# Altium schematic sheet FT232.SchDoc
size A4; SheetNumber: 4; SheetTotal: 5
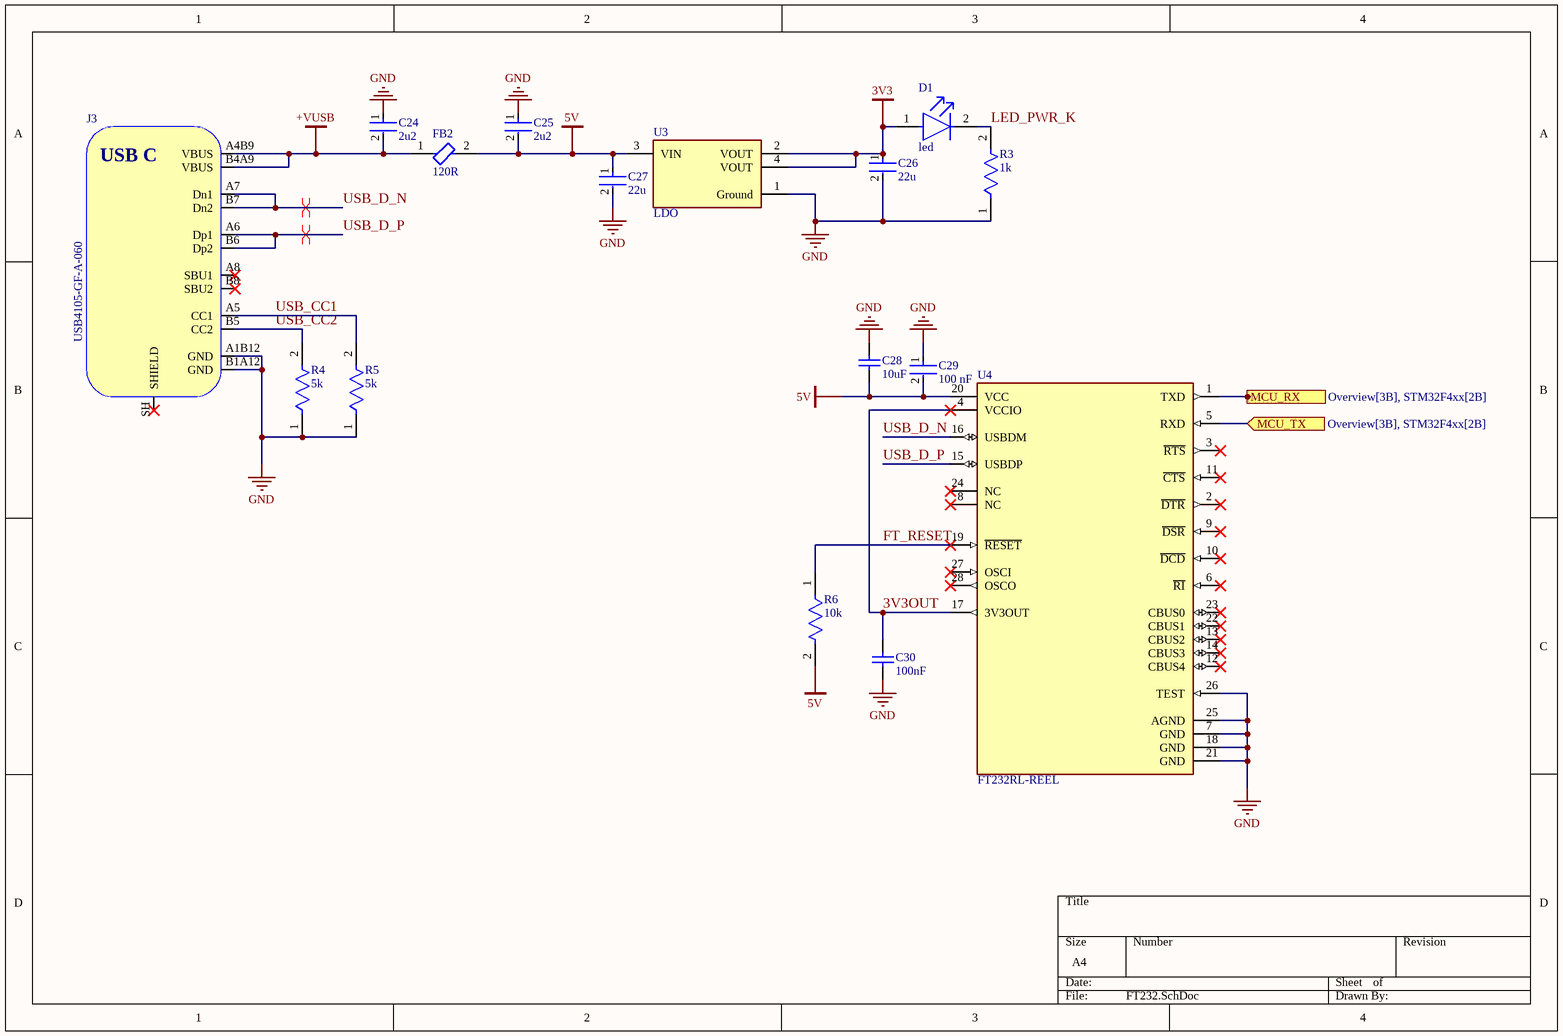
[diagram p0: FT232.SchDoc]

## Parts
C24  2u2  [FP-CC0603-DA-MFG]
C25  2u2  [FP-CC0603-DA-MFG]
C26  22u  [FP-GRM21B-0_2-e0_2_0_7-IPC_C]
C27  22u  [FP-GRM21B-0_2-e0_2_0_7-IPC_C]
C28  10uF  [CAPC0603(1608)100_M]
C29  100 nF  [FP-C0402-BB-MFG]
C30  100nF  [CAPC2013X145X50ML20T25]
D1  led  [FP-SM0402GC-MFG]
FB2  120R  [FP-BLM21-0_2-t0_85-e0_5-IPC_C]
J3  USB4105-GF-A-060  [USB4105-GF-A-060]
R3  1k  [FP-MCS0402-IPC_C]
R4  5k  [FP-TFCR0603-IPC_A]
R5  5k  [FP-TFCR0603-IPC_A]
R6  10k  [FP-AC0603-IPC_A]
U3  LDO  [FP-AMS1117-IPC_C]
U4  FT232RL-REEL  [FP-SSOP-28-MFG]

## Ports
MCU_RX (out, see Overview[3B], STM32F4xx[2B]), MCU_TX (in, see Overview[3B], STM32F4xx[2B])

## Nets
3V3: C26.1 D1.1(A) U3.2(VOUT) U3.4(VOUT)
5V: C25.2 C27.1 C28.1 C29.2 FB2.2 R6.2 U3.3(VIN) U4.20(VCC)
+VUSB: C24.2 FB2.1 J3.A4B9(VBUS) J3.B4A9(VBUS)
GND: C24.1 C25.1 C26.2 C27.2 C28.2 C29.1 C30.1 J3.A1B12(GND) J3.B1A12(GND) R3.1 R4.1 R5.1 U3.1(Ground) U4.7(GND) U4.18(GND) U4.21(GND) U4.25(AGND) U4.26(TEST)
3V3OUT: C30.2 U4.4(VCCIO) U4.17(3V3OUT)
FT_RESET: R6.1 U4.19(~{RESET})
LED_PWR_K: D1.2(C) R3.2
MCU_RX: U4.1(TXD) ; port MCU_RX
MCU_TX: U4.5(RXD) ; port MCU_TX
USB_CC1: J3.A5(CC1) R5.2
USB_CC2: J3.B5(CC2) R4.2
USB_D_N: J3.A7(Dn1) J3.B7(Dn2) U4.16(USBDM)
USB_D_P: J3.A6(Dp1) J3.B6(Dp2) U4.15(USBDP)

Not connected (* = marked no-connect by the designer): J3 A8(SBU1)* B8(SBU2)* SH(SHIELD)*; U4 2(~{DTR})* 3(~{RTS})* 6(~{RI})* 8(NC)* 9(~{DSR})* 10(~{DCD})* 11(~{CTS})* 12(CBUS4)* 13(CBUS2)* 14(CBUS3)* 22(CBUS1)* 23(CBUS0)* 24(NC)* 27(OSCI)* 28(OSCO)*

## Layout directives
differential pair; differential pair class DIFF_USB: USB_D_N, USB_D_P

## Notes on the sheet
- (in symbol USB4105-GF-A-060) USB C

## Library data of the parts
C24 C25 = CMP-03422-000257-1: CAP CER 2.2UF 16V X5R 0603; Manufacturer Part Number: CC0603MRX5R7BB225; Manufacturer: YAGEO; Tolerance: 0.2; Temperature Coefficient: 15%; Material: Ceramic; Mouser Description: Multilayer Ceramic Capacitors MLCC - SMD/SMT 2.2uF 16V 20% Ceramic Capacitor; Temperature Range Low: -55°C; Lead Free: Yes; Device Class L1: Passive Components; Device Class L2: Capacitors; Temperature Characteristic: X5R; Height: 0.9mm; Digikey Description: CAP CER 2.2UF 16V X5R 0603; Package: CC0603-DA; RoHS: TRUE; Capacitance: 2.2 uF; Automotive: No; Value: 2.2 uF; Device Class L3: Ceramic Capacitors; Voltage: 16 V; ComponentLink2URL: http://www.yageo.com/documents/recent/UPY-GPHC_X7R_6.3V-to-50V_18.pdf; Footprint Url: http://www.yageo.com/exep/pages/download/literatures/UPY-C_GEN_24.pdf; Octopart: https://octopart.com/cc0603mrx5r7bb225-yageo-81932636; Temperature Range High: +125°C; Temperature: -55°C to +125°C; Category: Cap; Voltage Rating: 16 V; ComponentLink2Description: Datasheet
C26 C27 = CMP-06035-025383-1: Chip Multilayer Ceramic Capacitors for General Purpose, 0805, 22uF, X5R, 15%, 20%, 16V; Weight: 0.000335oz; Case/Package: 0805; Dielectric: X5R; Min Operating Temperature: -55°C; Tolerance: 20%; Packaging: Tape and Reel; Package Quantity: 10000; Mount: Surface Mount; Thickness: 0.057inch; Capacitance: 22uF; Length: 0.079inch; Max Operating Temperature: 85°C; Voltage Rating: 16V; Width: 0.049inch; Voltage Rating (DC): 16V
C28 = CMP-1035-02796-1: CAP 10uF 6.3V ±10% 0603 (1608 Metric) Thickness 1mm SMD; Case-EIA: 0603; Tolerance: Â±10%; Case-Metric: 1608; Value: 10uF; Technology: SMT; Rated Voltage: 6.3 V; Max Thickness: 1 mm
C29 = CMP-03020-014070-2: CAP CER 0.1UF 25V X5R 0402; Manufacturer: Kemet; Manufacturer Part Number: C0402C104M3PAC7867; Material: Ceramic; Tolerance: 0.2; Value: 0.10 μF; Temperature Coefficient: 15%; Height: 0.55mm; Category: Cap; Temperature: -55°C to +125°C; Automotive: No; Package: C0402-BB; Temperature Range Low: -55°C; ComponentLink2Description: Datasheet; Device Class L3: Ceramic Capacitors; ComponentLink2URL: https://content.kemet.com/datasheets/KEM_C1002_X7R_SMD.pdf; Octopart: https://octopart.com/c0402c104m3pac7867-kemet-84304880; Temperature Characteristic: X5R; RoHS: TRUE; Temperature Range High: +125°C; Device Class L1: Passive Components; Capacitance: 0.10 μF; Lead Free: Yes; Voltage Rating: 25 V; Ipc Land Pattern Name: CAPC10050X50; Device Class L2: Capacitors; Digikey Description: CAP CER 0.1UF 25V X5R 0402
C30 = CMP-1036-04420-2: Manufacturer: Kemet; Part Number: C0805C104K5RACTM
D1 = CMP-35283-000001-2: LED GREEN CLEAR 0402 SMD; Lens Size: 1mm; Luminous Intensity: 28.5mcd; Viewing Angle: 130°; Forward Voltage: 1.9V; Test Current: 20mA; Lens Color: Colorless; Lens Style: Flat; Dominant Wavelength: 572nm; Case Code (Metric): 1005; Mount: Surface Mount; Case Code (Imperial): 0402; Length: 1mm; Width: 0.5mm; Case/Package: 0402; Lens Transparency: Clear; Height: 0.71mm; Packaging: Tape and Reel; Color: Green
FB2 = CMP-06046-002606-1: Chip Ferrite Bead, 0805, 60Ω @ 100MHz, 0.02Ω, 25%, 1.9A; RoHS Compliant: No
J3 = USB4105-GF-A-060: USB Connector Type C SMT 12 Pin; Manufacturer: GCT; Manufacturer Part Number: USB4105-GF-A-060; Distributor Link: https://eu.mouser.com/ProductDetail/GCT/USB4105-GF-A-060?qs=QNEnbhJQKvY2mocwNJzgfA%3D%3D
R3 = CMP-2002-02445-2: RES SMD 1.2K OHM 1% 1/10W 0402; Resistance: 1kR; Tolerance: 0.1%; Max Power Dissipation: 63mW; Temperature Coefficient: 25ppm/°C; Max Operating Temperature: 125°C; Min Operating Temperature: -55°C; Case/Package: 0402; Packaging: Tape and Reel; Width: 0.02inch; Lead Free: Lead Free; Number of Terminations: 2; Height: 0.015inch; Package Quantity: 10000; Length: 0.039inch; Composition: Thin Film; Contact Plating: Tin; Depth: 0.5mm; Military Standard: Not
R4 R5 = CMP-250906-062905-1: RES Thin Film,  4kΩ, 0.1%, 0.1W, 25ppm/°C, 0603
R6 = CMP-03412-040683-1: RES 10kΩ 5.00% 0.2W 0603
U3 = CMP-209535-000001-1: LDO Voltage Regulators 1A, 3.3V; Manufacturer Part Number: AMS1117-3.3; Manufacturer: Advanced Monolithic Systems; Dropout Voltage: 1.1V; Output Type: Fixed; Nominal Supply Current: 5mA; Max Power Dissipation: 1.2W; Max Supply Voltage: 15V; Number Of Outputs: 1; Standoff Height: 0.64mm; Max Junction Temp: +125°C; Height: 1.8mm; Package: AMS1117; Device Class L2: Power Management ICs; ComponentLink2Description: Datasheet; ComponentLink2URL: http://www.advanced-monolithic.com/pdf/ds1117.pdf; Category: IC; RoHS: TRUE; Automotive: No; Device Class L1: Integrated Circuits (ICs); Output Current: 1A; Device Class L3: Voltage Regulators - Linear; Temperature: -40°C to +125°C; Output Voltage: 3.3V; Temperature Range Low: -40°C; Octopart: https://octopart.com/ams1117-3.3-advanced+monolithic+systems-25899300; Lead Free: Yes; Ipc Land Pattern Name: SOT229P700X180-4; Temperature Range High: +125°C
U4 = CMP-0078-00029-4: IC USB FS SERIAL UART 28-SSOP; Data Rate: 12Mbps; Max Supply Voltage: 5.25V; Operating Supply Current: 15mA; Number of Channels: 1; Voltage: 5V; Min Supply Voltage: 3.3V; Radiation Hardening: No; Mount: Surface Mount; Min Operating Temperature: -40°C; Package Quantity: 2000; Number of Transceivers: 1; Width: 5.3mm; Number of Pins: 28; Height: 1.75mm; Weight: 0.080001oz; Lead Free: Lead Free; Length: 10.2mm; REACH SVHC: No SVHC; Max Operating Temperature: 85°C; Packaging: Tape and Reel; Interface: UART; Case/Package: SSOP